# EAGLE design AnySensePro (EAGLE 7.0.0)
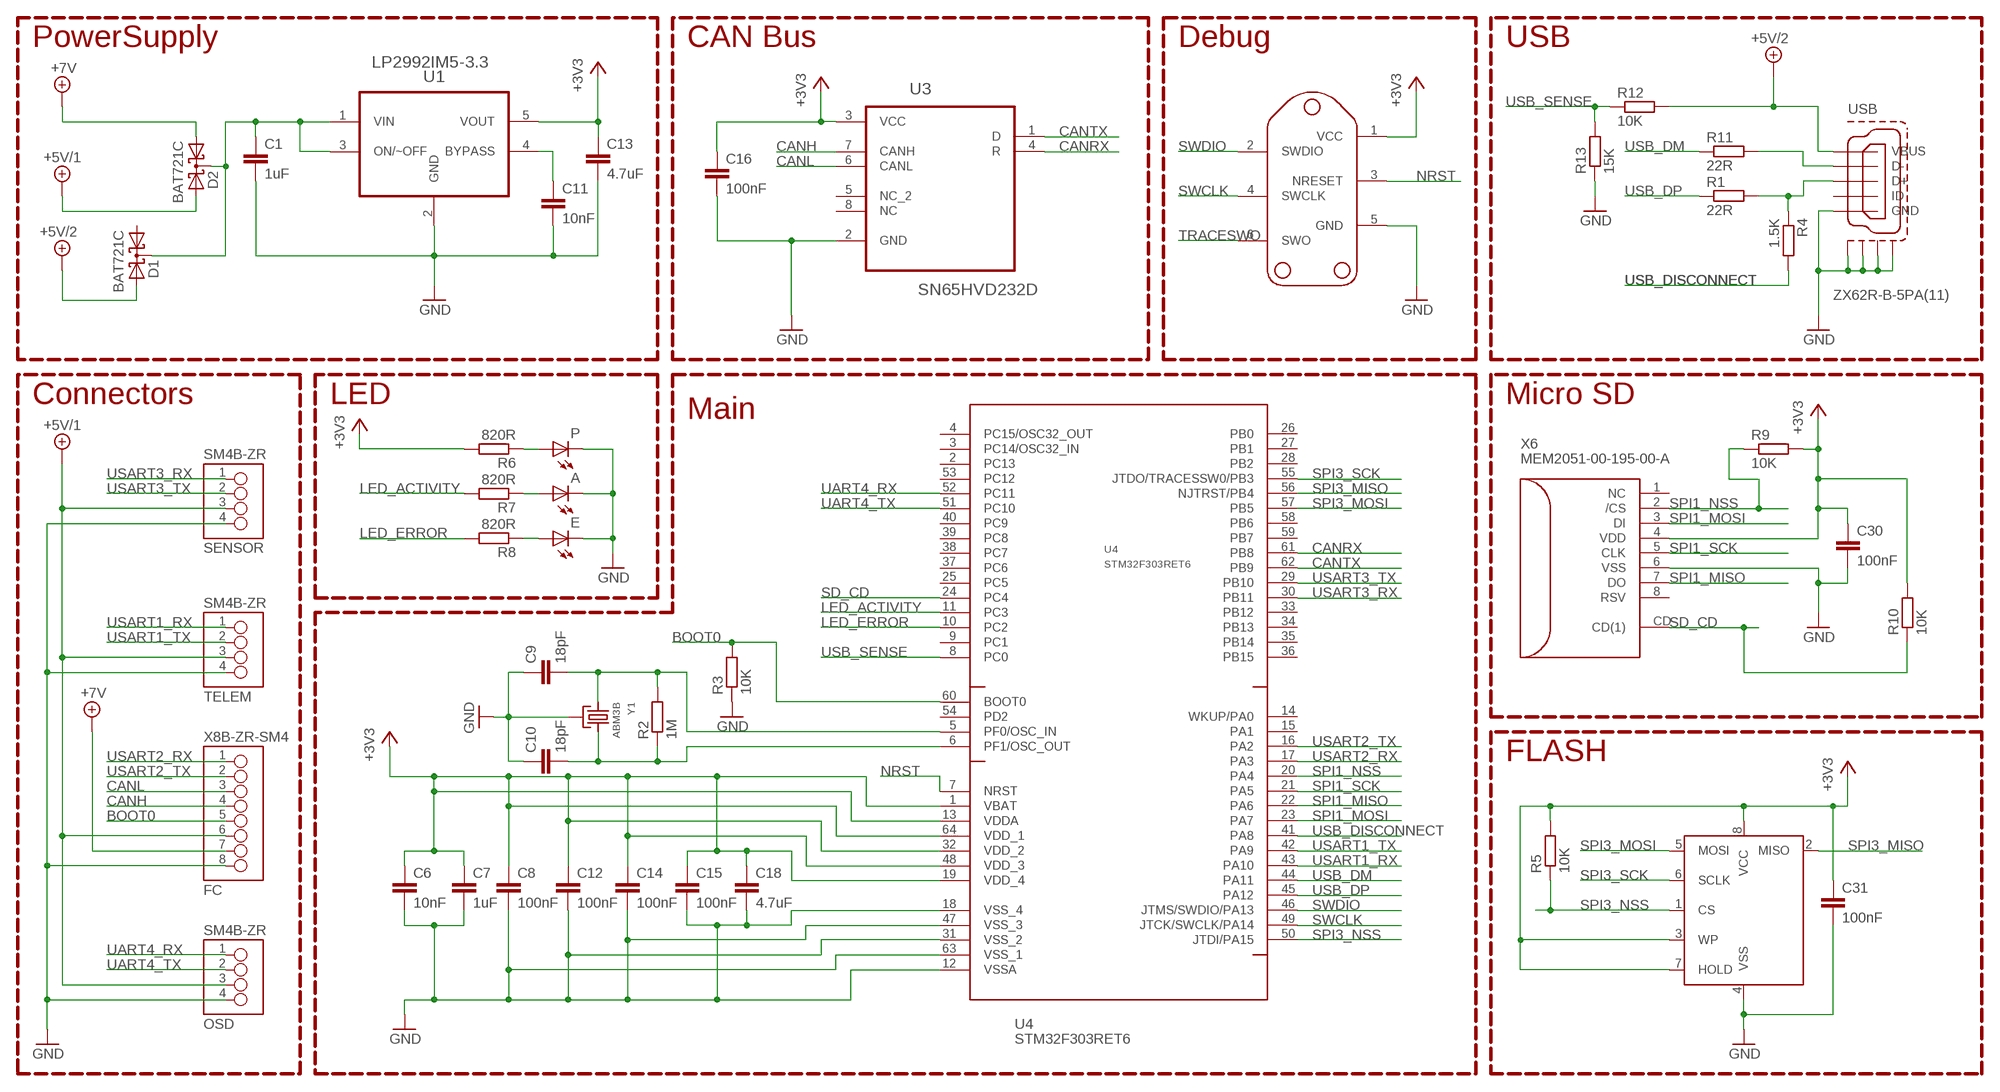
[diagram p0: schematic, sheet 1]

## Parts
A  LEDCHIP-LED0603  [CHIP-LED0603]
C1  1uF  C-EUC0603K  [C0603K]
C6  10nF  C-EUC0402K  [C0402K]
C7  1uF  C-EUC0402K  [C0402K]
C8  100nF  C-EUC0402K  [C0402K]
C9  18pF  C-EUC0402K  [C0402K]
C10  18pF  C-EUC0402K  [C0402K]
C11  10nF  C-EUC0402K  [C0402K]
C12  100nF  C-EUC0402K  [C0402K]
C13  4.7uF  C-EUC0603K  [C0603K]
C14  100nF  C-EUC0402K  [C0402K]
C15  100nF  C-EUC0402K  [C0402K]
C16  100nF  C-EUC0402K  [C0402K]
C18  4.7uF  C-EUC0603K  [C0603K]
C30  100nF  C-EUC0402K  [C0402K]
C31  100nF  C-EUC0402K  [C0402K]
D1  BAT721C  [SOT23]
D2  BAT721C  [SOT23]
E  LEDCHIP-LED0603  [CHIP-LED0603]
FC  X8B-ZR-SM4  [S8B-ZR-SM4]
OSD  SM4B-ZR  [S4B-ZR-SM4]
P  LEDCHIP-LED0603  [CHIP-LED0603]
R1  22R  R-EU_R0402  [R0402]
R2  1M  R-EU_R0402  [R0402]
R3  10K  R-EU_R0402  [R0402]
R4  1.5K  R-EU_R0402  [R0402]
R5  10K  R-EU_R0402  [R0402]
R6  820R  R-EU_R0402  [R0402]
R7  820R  R-EU_R0402  [R0402]
R8  820R  R-EU_R0402  [R0402]
R9  10K  R-EU_R0402  [R0402]
R10  10K  R-EU_R0402  [R0402]
R11  22R  R-EU_R0402  [R0402]
R12  10K  R-EU_R0402  [R0402]
R13  15K  R-EU_R0402  [R0402]
SENSOR  SM4B-ZR  [S4B-ZR-SM4]
TELEM  SM4B-ZR  [S4B-ZR-SM4]
U1  LP2992IM5-3.3  [SOT-23]
U3  SN65HVD232D  [SOIC127P600X175-8N]
U4  STM32F303RET6  [LQFP64]
U6  M25P16VMN6P  [M25P16]
USB  ZX62R-B-5PA(11)  [ZX62R-B-5PA(11)]
X6  MEM2051-00-195-00-A  [MEM2051]
X7  TC2030-IDC-NL  [TC2030-IDC]
Y1  ABM3B  ABM3B-8.000MHZ-B2-T  [5X3.2MM]

## Nets
+3V3: C6.1 C7.1 C8.1 C12.1 C13.1 C14.1 C15.1 C16.1 C18.1 C30.1 C31.1 R5.2 R6.2 R9.2 R10.2 U1.5(VOUT) U3.3(VCC) U4.1(VBAT) U4.13(VDDA) U4.19(VDD_4) U4.32(VDD_2) U4.48(VDD_3) U4.64(VDD_1) U6.3(WP) U6.7(HOLD) U6.8(VCC) X6.4(VDD) X7.1(VCC)
+5V/1: D2.2(A2) FC.6 OSD.3 SENSOR.3 TELEM.3
+5V/2: D1.2(A2) R12.2 USB.1(VBUS)
+7V: D2.1(A1) FC.7
BOOT0: FC.5 R3.2 U4.60(BOOT0)
CANH: FC.4 U3.7(CANH)
CANL: FC.3 U3.6(CANL)
CANRX: U3.4(R) U4.61(PB8)
CANTX: U3.1(D) U4.62(PB9)
GND: A.C C1.2 C6.2 C7.2 C8.2 C9.1 C10.1 C11.2 C12.2 C13.2 C14.2 C15.2 C16.2 C18.2 C30.2 C31.2 E.C FC.8 OSD.4 P.C R3.1 R13.1 SENSOR.4 TELEM.4 U1.2(GND) U3.2(GND) U4.12(VSSA) U4.18(VSS_4) U4.31(VSS_2) U4.47(VSS_3) U4.63(VSS_1) U6.4(VSS) USB.5(GND) USB.M1(S1) USB.M2(S2) USB.M3(S3) USB.M4(S4) X6.6(VSS) X7.5(GND) Y1.2(GND) Y1.4(GND)
LED_ACTIVITY: R7.2 U4.11(PC3)
LED_ERROR: R8.2 U4.10(PC2)
N$1: C1.1 D1.3(CC) D2.3(CC) U1.1(VIN) U1.3(ON/~OFF)
N$6: C10.2 R2.1 U4.6(PF1/OSC_OUT) Y1.3
N$7: C11.1 U1.4(BYPASS)
N$8: C9.2 R2.2 U4.5(PF0/OSC_IN) Y1.1
N$15: P.A R6.1
N$18: A.A R7.1
N$19: E.A R8.1
NRST: U4.7(NRST) X7.3(NRESET)
SD_CD: R10.1 U4.24(PC4) X6.CD(CD(1))
SPI1_MISO: U4.22(PA6) X6.7(DO)
SPI1_MOSI: U4.23(PA7) X6.3(DI)
SPI1_NSS: R9.1 U4.20(PA4) X6.2(/CS)
SPI1_SCK: U4.21(PA5) X6.5(CLK)
SPI3_MISO: U4.56(NJTRST/PB4) U6.2(MISO)
SPI3_MOSI: U4.57(PB5) U6.5(MOSI)
SPI3_NSS: R5.1 U4.50(JTDI/PA15) U6.1(CS)
SPI3_SCK: U4.55(JTDO/TRACESSW0/PB3) U6.6(SCLK)
SWCLK: U4.49(JTCK/SWCLK/PA14) X7.4(SWCLK)
SWDIO: U4.46(JTMS/SWDIO/PA13) X7.2(SWDIO)
TRACESWO: X7.6(SWO)
UART4_RX: OSD.1 U4.52(PC11)
UART4_TX: OSD.2 U4.51(PC10)
USART1_RX: TELEM.1 U4.43(PA10)
USART1_TX: TELEM.2 U4.42(PA9)
USART2_RX: FC.1 U4.17(PA3)
USART2_TX: FC.2 U4.16(PA2)
USART3_RX: SENSOR.1 U4.30(PB11)
USART3_TX: SENSOR.2 U4.29(PB10)
USB_D+: R1.2 R4.1 USB.3(D+)
USB_D-: R11.2 USB.2(D-)
USB_DISCONNECT: R4.2 U4.41(PA8)
USB_DM: R11.1 U4.44(PA11)
USB_DP: R1.1 U4.45(PA12)
USB_SENSE: R12.1 R13.2 U4.8(PC0)
Unconnected: D1.1(A1) U3.5(NC_2) U3.8(NC) U4.2(PC13) U4.3(PC14/OSC32_IN) U4.4(PC15/OSC32_OUT) U4.9(PC1) U4.14(WKUP/PA0) U4.15(PA1) U4.25(PC5) U4.26(PB0) U4.27(PB1) U4.28(PB2) U4.33(PB12) U4.34(PB13) U4.35(PB14) U4.36(PB15) U4.37(PC6) U4.38(PC7) U4.39(PC8) U4.40(PC9) U4.53(PC12) U4.54(PD2) U4.58(PB6) U4.59(PB7) USB.4(ID) X6.1(NC) X6.8(RSV)

## Notes on the sheet
- PowerSupply | CAN Bus | Debug | USB
- Connectors | LED | Micro SD
- Main
- FLASH

## Library data of the parts
A = led:LED: LED OSRAM: - CHIPLED LG R971, LG N971, LY N971, LG Q971, LY Q971, LO R971, LY R971 LH N974, LH R974 LS Q976, LO Q976, LY Q976 LO Q996 - Hyper CHIPLED LW Q18S LB Q993, LB Q99A, LB R99A - SideLED LS A670, LO A670, LY A670, LG A670, LP A670 LB A673, LV A673, LT A673, LW A673 LH A674 LY A675 LS A676, LA A676, LO A676, LY A676, LW A676 LS A679, LY A679, LG A679 - Hyper Micro SIDELED® LS Y876, LA Y876, LO Y876, LY Y876 LT Y87S - SmartLED LW L88C, LW L88S LB L89C, LB L89S, LG L890 LS L89K, LO L89K, LY L89K LS L896, LA L896, LO L896, LY L896 - TOPLED LS T670, LO T670, LY T670, LG T670, LP T670 LSG T670, LSP T670, LSY T670, LOP T670, LYG T670 LG T671, LOG T671, LSG T671 LB T673, LV T673, LT T673, LW T673 LH T674 LS T676, LA T676, LO T676, LY T676, LB T676, LH T676, LSB T676, LW T676 LB T67C, LV T67C, LT T67C, LS T67K, LO T67K, LY T67K, LW E67C LS E67B, LA E67B, LO E67B, LY E67B, LB E67C, LV E67C, LT E67C LW T67C LS T679, LY T679, LG T679 LS T770, LO T770, LY T770, LG T770, LP T770 LB T773, LV T773, LT T773, LW T773 LH T774 LS E675, LA E675, LY E675, LS T675 LS T776, LA T776, LO T776, LY T776, LB T776 LHGB T686 LT T68C, LB T68C - Hyper Mini TOPLED® LB M676 - Mini TOPLED Santana® LG M470 LS M47K, LO M47K, LY M47K Source: http://www.osram.convergy.de LUXEON: - LUMILED® LXK2-PW12-R00, LXK2-PW12-S00, LXK2-PW14-U00, LXK2-PW14-V00 LXK2-PM12-R00, LXK2-PM12-S00, LXK2-PM14-U00 LXK2-PE12-Q00, LXK2-PE12-R00, LXK2-PE12-S00, LXK2-PE14-T00, LXK2-PE14-U00 LXK2-PB12-K00, LXK2-PB12-L00, LXK2-PB12-M00, LXK2-PB14-N00, LXK2-PB14-P00, LXK2-PB14-Q00 LXK2-PR12-L00, LXK2-PR12-M00, LXK2-PR14-Q00, LXK2-PR14-R00 LXK2-PD12-Q00, LXK2-PD12-R00, LXK2-PD12-S00 LXK2-PH12-R00, LXK2-PH12-S00 LXK2-PL12-P00, LXK2-PL12-Q00, LXK2-PL12-R00 Source: www.luxeon.com KINGBRIGHT: KA-3528ASYC Source: www.kingbright.com; OC_FARNELL: 2468793RL
C1 = rcl:C-EU: CAPACITOR, European symbol; OC_FARNELL: 1759409RL
C6 C11 = rcl:C-EU: CAPACITOR, European symbol; OC_FARNELL: 1758924RL
C7 = rcl:C-EU: CAPACITOR, European symbol; OC_FARNELL: 2320776RL
C8 C12 C14-C16 C30 C31 = rcl:C-EU: CAPACITOR, European symbol; OC_FARNELL: 1759380RL
C9 C10 = rcl:C-EU: CAPACITOR, European symbol; OC_FARNELL: 1758947RL
C13 C18 = rcl:C-EU: CAPACITOR, European symbol; OC_FARNELL: 2320818RL
D1 D2 = diode:BAT721C: Schottky Diodes Source: Datasheet BAT721 series <http://www.farnell.com/datasheets/453891.pdf>; OC_FARNELL: 1081199RL
E = led:LED: LED OSRAM: - CHIPLED LG R971, LG N971, LY N971, LG Q971, LY Q971, LO R971, LY R971 LH N974, LH R974 LS Q976, LO Q976, LY Q976 LO Q996 - Hyper CHIPLED LW Q18S LB Q993, LB Q99A, LB R99A - SideLED LS A670, LO A670, LY A670, LG A670, LP A670 LB A673, LV A673, LT A673, LW A673 LH A674 LY A675 LS A676, LA A676, LO A676, LY A676, LW A676 LS A679, LY A679, LG A679 - Hyper Micro SIDELED® LS Y876, LA Y876, LO Y876, LY Y876 LT Y87S - SmartLED LW L88C, LW L88S LB L89C, LB L89S, LG L890 LS L89K, LO L89K, LY L89K LS L896, LA L896, LO L896, LY L896 - TOPLED LS T670, LO T670, LY T670, LG T670, LP T670 LSG T670, LSP T670, LSY T670, LOP T670, LYG T670 LG T671, LOG T671, LSG T671 LB T673, LV T673, LT T673, LW T673 LH T674 LS T676, LA T676, LO T676, LY T676, LB T676, LH T676, LSB T676, LW T676 LB T67C, LV T67C, LT T67C, LS T67K, LO T67K, LY T67K, LW E67C LS E67B, LA E67B, LO E67B, LY E67B, LB E67C, LV E67C, LT E67C LW T67C LS T679, LY T679, LG T679 LS T770, LO T770, LY T770, LG T770, LP T770 LB T773, LV T773, LT T773, LW T773 LH T774 LS E675, LA E675, LY E675, LS T675 LS T776, LA T776, LO T776, LY T776, LB T776 LHGB T686 LT T68C, LB T68C - Hyper Mini TOPLED® LB M676 - Mini TOPLED Santana® LG M470 LS M47K, LO M47K, LY M47K Source: http://www.osram.convergy.de LUXEON: - LUMILED® LXK2-PW12-R00, LXK2-PW12-S00, LXK2-PW14-U00, LXK2-PW14-V00 LXK2-PM12-R00, LXK2-PM12-S00, LXK2-PM14-U00 LXK2-PE12-Q00, LXK2-PE12-R00, LXK2-PE12-S00, LXK2-PE14-T00, LXK2-PE14-U00 LXK2-PB12-K00, LXK2-PB12-L00, LXK2-PB12-M00, LXK2-PB14-N00, LXK2-PB14-P00, LXK2-PB14-Q00 LXK2-PR12-L00, LXK2-PR12-M00, LXK2-PR14-Q00, LXK2-PR14-R00 LXK2-PD12-Q00, LXK2-PD12-R00, LXK2-PD12-S00 LXK2-PH12-R00, LXK2-PH12-S00 LXK2-PL12-P00, LXK2-PL12-Q00, LXK2-PL12-R00 Source: www.luxeon.com KINGBRIGHT: KA-3528ASYC Source: www.kingbright.com; OC_FARNELL: 2468792RL
FC = con-jst:X8B-ZR-?: JST ZH Connector; OC_FARNELL: 1830925
OSD SENSOR TELEM = con-jst:?4B-ZR: ZH Connector: 1.5mm pitch/Disconnectable Crimp style connector Datasheet <http://www.farnell.com/datasheets/621906.pdf>; OC_FARNELL: 1830923
P = led:LED: LED OSRAM: - CHIPLED LG R971, LG N971, LY N971, LG Q971, LY Q971, LO R971, LY R971 LH N974, LH R974 LS Q976, LO Q976, LY Q976 LO Q996 - Hyper CHIPLED LW Q18S LB Q993, LB Q99A, LB R99A - SideLED LS A670, LO A670, LY A670, LG A670, LP A670 LB A673, LV A673, LT A673, LW A673 LH A674 LY A675 LS A676, LA A676, LO A676, LY A676, LW A676 LS A679, LY A679, LG A679 - Hyper Micro SIDELED® LS Y876, LA Y876, LO Y876, LY Y876 LT Y87S - SmartLED LW L88C, LW L88S LB L89C, LB L89S, LG L890 LS L89K, LO L89K, LY L89K LS L896, LA L896, LO L896, LY L896 - TOPLED LS T670, LO T670, LY T670, LG T670, LP T670 LSG T670, LSP T670, LSY T670, LOP T670, LYG T670 LG T671, LOG T671, LSG T671 LB T673, LV T673, LT T673, LW T673 LH T674 LS T676, LA T676, LO T676, LY T676, LB T676, LH T676, LSB T676, LW T676 LB T67C, LV T67C, LT T67C, LS T67K, LO T67K, LY T67K, LW E67C LS E67B, LA E67B, LO E67B, LY E67B, LB E67C, LV E67C, LT E67C LW T67C LS T679, LY T679, LG T679 LS T770, LO T770, LY T770, LG T770, LP T770 LB T773, LV T773, LT T773, LW T773 LH T774 LS E675, LA E675, LY E675, LS T675 LS T776, LA T776, LO T776, LY T776, LB T776 LHGB T686 LT T68C, LB T68C - Hyper Mini TOPLED® LB M676 - Mini TOPLED Santana® LG M470 LS M47K, LO M47K, LY M47K Source: http://www.osram.convergy.de LUXEON: - LUMILED® LXK2-PW12-R00, LXK2-PW12-S00, LXK2-PW14-U00, LXK2-PW14-V00 LXK2-PM12-R00, LXK2-PM12-S00, LXK2-PM14-U00 LXK2-PE12-Q00, LXK2-PE12-R00, LXK2-PE12-S00, LXK2-PE14-T00, LXK2-PE14-U00 LXK2-PB12-K00, LXK2-PB12-L00, LXK2-PB12-M00, LXK2-PB14-N00, LXK2-PB14-P00, LXK2-PB14-Q00 LXK2-PR12-L00, LXK2-PR12-M00, LXK2-PR14-Q00, LXK2-PR14-R00 LXK2-PD12-Q00, LXK2-PD12-R00, LXK2-PD12-S00 LXK2-PH12-R00, LXK2-PH12-S00 LXK2-PL12-P00, LXK2-PL12-Q00, LXK2-PL12-R00 Source: www.luxeon.com KINGBRIGHT: KA-3528ASYC Source: www.kingbright.com; OC_FARNELL: 2468791RL
R1 R11 = rcl:R-EU_: RESISTOR, European symbol; OC_FARNELL: 2302453RL
R2 = rcl:R-EU_: RESISTOR, European symbol; OC_FARNELL: 2302957RL
R3 R5 R9 R10 R12 = rcl:R-EU_: RESISTOR, European symbol; OC_FARNELL: 2302739RL
R4 = rcl:R-EU_: RESISTOR, European symbol; OC_FARNELL: 2302656RL
R6-R8 = rcl:R-EU_: RESISTOR, European symbol; OC_FARNELL: 2302628RL
R13 = rcl:R-EU_: RESISTOR, European symbol; OC_FARNELL: 2302754RL
U1 = texas:LP2992IM5: Low-Dropout Regulator; MPN: LP2992IM5-3.3; OC_FARNELL: 1469141RL
U3 = texas:SN65HVD232D: 3.3-V CAN TRANSCEIVERS; MPN: SN65HVD232D; OC_FARNELL: 1103107; OC_NEWARK: 35K4890; PACKAGE: SOIC-8; SUPPLIER: Texas Instruments
U4 = stm32F:STM32F3: ARM® Cortex®-M4 32b MCU+FPU, up to 512KB Flash, 80KB SRAM, FMC, 4 ADCs, 2 DAC ch., 7 comp, 4 Op-Amp, 2.0-3.6 V; OC_FARNELL: 2466939
U6 = micron:M25P16; OC_FARNELL: 1734973
USB = con-hirose:ZX62R-B-5?: Micro USB Connector Source: http://www.farnell.com/datasheets/1693470.pdf; OC_FARNELL: 1645325
X6 = con-gct:MEM2051: GLOBAL CONNECTOR TECHNOLOGY MEM2051-00-195-00-A STECKPLATZ, MICRO-SD, 8POS, SMT Hersteller: GLOBAL CONNECTOR TECHNOLOGY Bestellnummer: 2443092 <http://de.farnell.com/global-connector-technology/mem2051-00-195-00-a/steckplatz-micro-sd-8pos-smt/dp/2443092> Herstellerteilenummer: MEM2051-00-195-00-A; OC_FARNELL: 2443092
X7 = con-tag-connect:TC2030-IDC-NL
Y1 = abracon:ABM; OC_FARNELL: 2467818RL

## Board
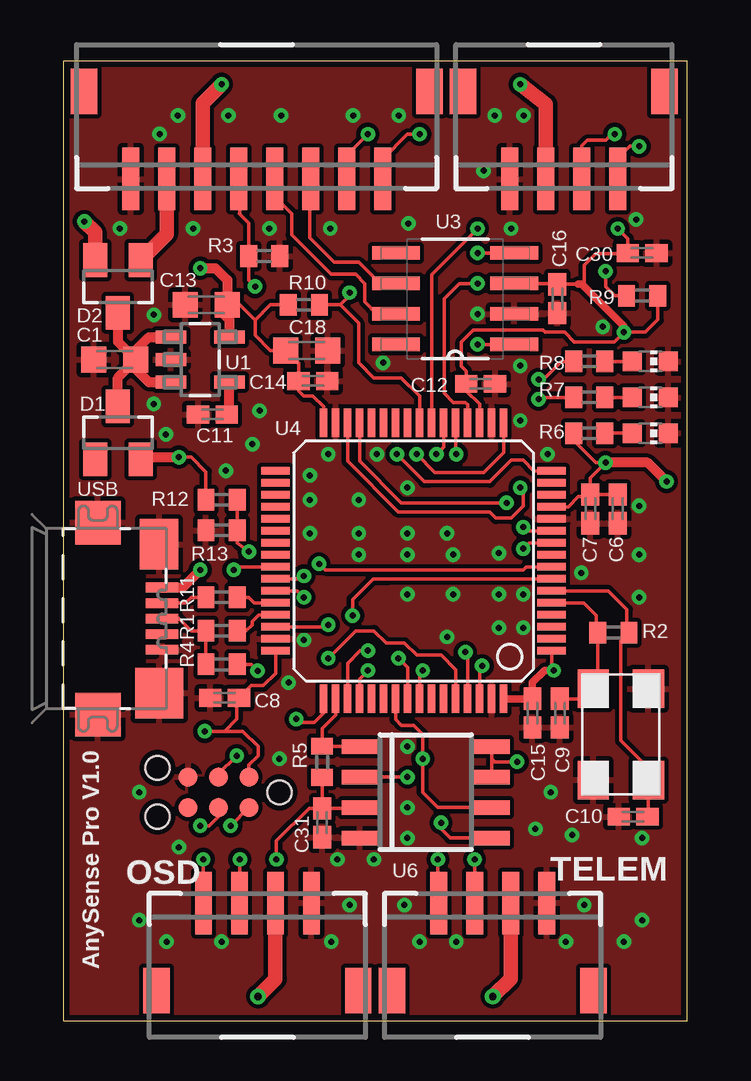
[diagram p1: board, top side]
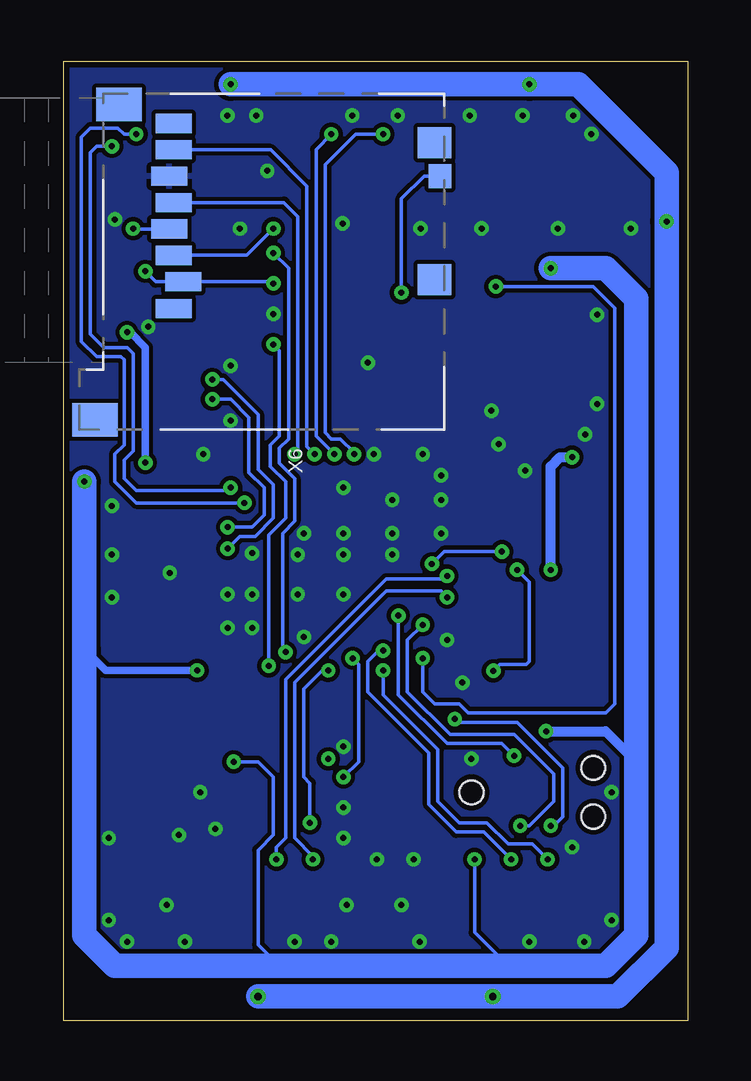
[diagram p2: board, bottom side, seen from below]

Size 26 x 40 mm. Coordinates in mm from the lower left corner, seen from the top.
Outline: 0,0 26,0 26,40 0,40 0,0
Copper layers (1*16): Top 0.035mm / dielectric 1.55mm / Bottom 0.035mm
Design rules "eC_2Layer_PClass6_BaseCopperO35 *": minimum track width 0.15mm, minimum drill 0.25mm, track to track 0.175mm, track to pad 0.175mm, pad to pad 0.175mm, via to via 0.175mm, smd to smd 0mil, copper to edge 0.25mm, drill to drill 0.35mm, minimum pad ring 0.175mm, minimum via ring 0.175mm, stop-mask expansion 0mil, vias tented up to drill 0.45mm, thermal gap 0.2mm

### Footprints (pad centres in the part's own frame; a part is rotated, then mirrored left to right if it is on the bottom)
CHIP-LED0603 = smd 0.8 x 0.8: A 0,-0.75; C 0,0.75
C0603K = smd 1.05 x 1.08: 1 -0.875,0; 2 0.875,0
C0402K = smd 0.925 x 0.74: 1 -0.6,0; 2 0.6,0
SOT23 = smd 1 x 1.4: 1 -0.95,-1.1; 2 0.95,-1.1; 3 0,1.1
S8B-ZR-SM4 = smd 0.7 x 2.6: 1 5.25,-2.6; 2 3.75,-2.6; 3 2.25,-2.6; 4 0.75,-2.6; 5 -0.75,-2.6; 6 -2.25,-2.6; 7 -3.75,-2.6; 8 -5.25,-2.6 | smd 1.1 x 1.9: P$1 7.2,1.05; P$2 -7.2,1.05
S4B-ZR-SM4 = smd 0.7 x 2.6: 1 2.25,-2.6; 2 0.75,-2.6; 3 -0.75,-2.6; 4 -2.25,-2.6 | smd 1.1 x 1.9: P$1 4.2,1.05; P$2 -4.2,1.05
R0402 = smd 0.7 x 0.9: 1 -0.65,0; 2 0.65,0
SOT-23 = smd 1.27 x 0.533: 1 -1.219,0.94; 2 -1.219,0; 3 -1.219,-0.94; 4 1.219,-0.94; 5 1.219,0.94
SOIC127P600X175-8N = smd 1.981 x 0.559: 1 -2.464,1.905; 2 -2.464,0.635; 3 -2.464,-0.635; 4 -2.464,-1.905; 5 2.464,-1.905; 6 2.464,-0.635; 7 2.464,0.635; 8 2.464,1.905
LQFP64 = smd 1.2 x 0.3: 1 -5.75,3.75; 2 -5.75,3.25; 3 -5.75,2.75; 4 -5.75,2.25; 5 -5.75,1.75; 6 -5.75,1.25; 7 -5.75,0.75; 8 -5.75,0.25; 9 -5.75,-0.25; 10 -5.75,-0.75; 11 -5.75,-1.25; 12 -5.75,-1.75; 13 -5.75,-2.25; 14 -5.75,-2.75; 15 -5.75,-3.25; 16 -5.75,-3.75; 33 5.75,-3.75; 34 5.75,-3.25; 35 5.75,-2.75; 36 5.75,-2.25; 37 5.75,-1.75; 38 5.75,-1.25; 39 5.75,-0.75; 40 5.75,-0.25; 41 5.75,0.25; 42 5.75,0.75; 43 5.75,1.25; 44 5.75,1.75; 45 5.75,2.25; 46 5.75,2.75; 47 5.75,3.25; 48 5.75,3.75 | smd 0.3 x 1.2: 17 -3.75,-5.75; 18 -3.25,-5.75; 19 -2.75,-5.75; 20 -2.25,-5.75; 21 -1.75,-5.75; 22 -1.25,-5.75; 23 -0.75,-5.75; 24 -0.25,-5.75; 25 0.25,-5.75; 26 0.75,-5.75; 27 1.25,-5.75; 28 1.75,-5.75; 29 2.25,-5.75; 30 2.75,-5.75; 31 3.25,-5.75; 32 3.75,-5.75; 49 3.75,5.75; 50 3.25,5.75; 51 2.75,5.75; 52 2.25,5.75; 53 1.75,5.75; 54 1.25,5.75; 55 0.75,5.75; 56 0.25,5.75; 57 -0.25,5.75; 58 -0.75,5.75; 59 -1.25,5.75; 60 -1.75,5.75; 61 -2.25,5.75; 62 -2.75,5.75; 63 -3.25,5.75; 64 -3.75,5.75
M25P16 = smd 0.6 x 1.5: 1 -1.905,-2.75; 2 -0.635,-2.75; 3 0.635,-2.75; 4 1.905,-2.75; 5 1.905,2.75; 6 0.635,2.75; 7 -0.635,2.75; 8 -1.905,2.75
ZX62R-B-5PA(11) = smd 1.35 x 0.4: 1 2.675,1.3; 2 2.675,0.65; 3 2.675,0; 4 2.675,-0.65; 5 2.675,-1.3 | smd 1.9 x 1.8: M1 0,-4; M2 0,4 | smd 1.6 x 2.1: M3 2.55,3.1 | smd 2 x 2.1: M4 2.55,-3.1
MEM2051 = smd 0.8 x 1.5: 1 2.06,-3.66; 2 0.94,-3.26; 3 -0.16,-3.66; 4 -1.26,-3.86; 5 -2.36,-3.66; 6 -3.46,-3.86; 7 -4.56,-3.66; 8 -5.66,-3.66 | smd 1 x 0.95: CD -3.46,7.425 | smd 1.4 x 1.9: P$1 -6.45,-5.95; P$2 6.7,-6.95 | smd 1.3 x 1.4: P$3 -4.85,7.2; P$4 0.85,7.2
TC2030-IDC = smd 0.787 x 0.787: 1 1.27,-0.635; 2 1.27,0.635; 3 2.54,-0.635; 4 2.54,0.635; 5 3.81,-0.635; 6 3.81,0.635 | hole 0.991: 0,0; 5.08,1.016; 5.08,-1.016
5X3.2MM = smd 1.6 x 1.3: 1 -1.9,-1.15; 2 1.9,-1.15; 3 1.9,1.15; 4 -1.9,1.15

### Placement (x,y rotation side)
A  24.46,25.99 270 top
C1  2.16,27.56 180 top
C6  23.11,21.34 270 top
C7  21.97,21.34 270 top
C8  6.73,13.46 180 top
C9  20.7,12.83 90 top
C10  23.75,8.51 0 top
C11  6.22,25.27 180 top
C12  17.4,26.55 0 top
C13  5.97,29.84 180 top
C14  10.41,26.67 0 top
C15  19.56,12.83 270 top
C16  20.6,30.1 270 top
C18  10.16,27.94 0 top
C30  24.13,32 0 top
C31  10.79,8.26 270 top
D1  2.29,24.51 0 top
D2  2.29,30.61 180 top
E  24.46,27.49 270 top
FC  8.07,37.69 0 top
OSD  8.1,2.31 180 top
P  24.46,24.49 270 top
R1  6.6,16.26 180 top
R2  22.93,16.18 180 top
R3  8.38,31.88 180 top
R4  6.6,14.86 0 top
R5  10.79,10.79 270 top
R6  21.93,24.49 180 top
R7  21.93,25.99 180 top
R8  21.93,27.49 180 top
R9  24.13,30.23 0 top
R10  10.03,29.84 180 top
R11  6.6,17.65 180 top
R12  6.6,21.72 180 top
R13  6.6,20.45 0 top
SENSOR  20.87,37.69 0 top
TELEM  17.9,2.31 180 top
U1  5.71,27.56 0 top
U3  16.34,30.1 180 top
U4  14.61,19.18 180 top
U6  15.11,9.53 270 top
USB  1.45,16.76 0 top
X6  17.76,31.75 270 bottom
X7  9.02,9.53 180 top
Y1  23.24,11.94 270 top

### Tracks (layer width: path | path; a pad name or v marks a point on that pad's centre or on a via)
+3V3  (via drill 0.25)
  Top 0.15: 21.84,23.62 22.2,23.27 v22.61,23.27 | 16.8,27.09 16.6,27.29 16.6,28.3 17.1,28.8 20,28.8 20.1,28.7 20.9,28.7 21.3,28.3 22.97,28.3 v23.37,28.7
  Top 0.152: U6.8 17.86,10.92 | 17.86,10.92 U6.7 | 8,29.21 8,28.57 8.64,27.94 C18.1 9.81,27.41 C14.1 9.81,26.25 10.03,26.04 10.41,26.04 10.86,25.59 U4.32 | 8,29.21 7.37,29.84 C13.1 | U4.1 20.36,14.7 v20.45,14.61 | 8,29.21 8.64,29.84 R10.2 | U4.48 8.86,14.48 8.35,13.97 7.84,13.97 C8.1 7.24,13.37 7.24,12.57 6.73,12.06 | 21.46,30.7 C16.1 20.57,30.73 U3.3 | 21.84,23.62 21.27,24.19 R6.2 | U4.13 21.05,21.43 21.46,21.84 21.88,21.84 C7.1 | C7.1 21.97,22.63 v22.61,23.27 | C7.1 21.97,21.84 | U4.19 17.36,25.7 16.8,26.25 C12.1 16.8,27.09 | R9.2 24.78,29.23 24.26,28.7 v23.37,28.7 | C7.1 C6.1 | C31.1 12.2,8.86 U6.3 | v5.91,12.06 6.73,12.06 | 6.73,12.06 7.49,12.06 8.13,11.43 8.13,11.05 7.75,10.67 X7.1 | 21.62,30.7 21.72,30.73 21.72,31.5 22.19,31.97 23.5,31.97 C30.1 23.53,32.6 v23.11,33.02 | C31.1 10.25,8.86 8.89,7.49 v8.89,6.73 | R5.2 C31.1 | v18.92,10.79 17.99,10.79 17.86,10.92
  Top 0.305: v23.37,28.7 23.37,28.96 21.62,30.7 21.46,30.7 | v20.45,14.61 20.07,14.61 19.56,14.1 C15.1 U4.64
  Top 0.406: v5.71,31.37 6.35,31.37 6.84,30.88 C13.1 6.55,29.61 6.93,29.23 U1.5 | v25.15,22.48 24.36,23.27 v22.61,23.27
  Bottom 0.152: 2.54,14.1 2.16,14.48 | X6.4 v23.1,33.01 v23.11,33.02 | v8.89,6.73 8.89,3.68 7.49,2.29 | 17.02,2.29 17.91,3.17 17.91,7.11 17.27,7.75 17.27,10.16 17.91,10.79 v18.92,10.79
  Bottom 0.305: v20.45,14.61 24.26,14.61 25.15,15.49 | v22.61,23.27 22.61,28.07 23.24,28.7 v23.37,28.7
  Bottom 0.406: v5.91,12.06 3.43,12.06 2.16,10.79
  Bottom 1.016: v5.71,31.37 3.43,31.37 2.16,30.1 2.16,14.48 2.16,10.79 2.16,3.56 3.43,2.29 7.49,2.29 17.02,2.29 23.88,2.29 25.15,3.56 25.15,15.49 v25.15,22.48
+5V/1  (via drill 0.25, 0.3)
  Top 0.61: v0.89,33.32 1.34,32.87 D2.2 | v19.05,39.04 20.12,38.2 SENSOR.3 | FC.6 5.82,38.25 v6.6,39.04 | TELEM.3 18.65,1.76 v17.91,1.02 | v8.13,1.02 8.85,1.74 OSD.3
  Bottom 1.016: v19.05,39.04 v6.6,39.04 4.57,39.04 0.89,35.35 v0.89,33.32 0.89,3.05 2.92,1.02 v8.13,1.02 v17.91,1.02
+5V/2  (via drill 0.25)
  Top 0.152: R12.2 5.95,22.88 5.33,23.5 v4.83,23.5
  Top 0.254: 3.32,23.5 D1.2
  Top 0.406: USB.1 4.98,18.06 v5.71,18.8 | 3.32,23.5 v4.83,23.5
  Bottom 0.406: v5.71,18.8 5.71,23.11 5.33,23.5 v4.83,23.5
+7V
  Top 0.61: FC.7 4.32,32.79 D2.1
BOOT0  (via drill 0.25)
  Top 0.152: FC.5 7.37,34.31 7.37,33.66 7.35,33.64 7.73,33.26 R3.2 7.73,30.88 v8,30.61 | v11.05,15.11 12.19,16.26 12.95,16.26 13.46,15.75 14.22,15.75 14.73,15.24 15.75,15.24 16.36,14.63 U4.60
  Bottom 0.152: v8,30.61 3.94,30.61 3.05,29.72 3.05,13.21 3.43,12.83 9.14,12.83 9.53,13.21 10.54,13.21 11.05,13.72 v11.05,15.11
CANH
  Top 0.152: FC.4 8.82,34.36 9.53,33.66 9.53,32.77 11.18,31.11 12.19,31.11 12.57,30.73 12.57,29.97 13.08,29.46 U3.7
CANL
  Top 0.152: FC.3 10.29,34.33 10.29,32.64 11.3,31.62 12.32,31.62 13.21,30.73 U3.6
CANRX  (via drill 0.25)
  Top 0.152: U3.4 v17.27,32 | v16.76,15.37 16.86,15.28 U4.61
  Bottom 0.152: v17.27,32 16.64,31.37 16.64,24.26 17.02,23.88 17.02,23.24 16.38,22.61 16.38,20.83 16.89,20.32 16.89,15.49 v16.76,15.37
CANTX  (via drill 0.25)
  Top 0.152: v17.27,28.19 U3.1 | U4.62 17.36,14.69 v17.46,14.8
  Bottom 0.152: v17.27,28.19 17.02,27.94 17.02,24.38 17.4,24 17.4,23.11 16.76,22.48 16.76,20.95 17.46,20.26 v17.46,14.8
GND  (via drill 0.25, 0.25 pad 0.38)
  other vias: 22.49,28.93 13.34,27.43 13.08,23.62 14.35,19.43 16.26,17.78 18.16,17.78 17.53,35.43 16.26,19.43 18.16,19.49 12.32,20.32 12.32,19.43 12.32,21.72 11.05,23.62 10.29,22.73 10.29,21.72 10.29,20.32 4.02,36.97 4.79,37.73 6.89,37.73 9.09,37.73 12.09,37.73 13.99,37.73 17.99,37.73 19.19,37.73 14.39,33.23 6.79,22.93 7.89,24.03 3.78,25.71 3.79,29.43 8.19,25.43 24.13,7.62 24.13,4.19 23.37,3.3 20.95,3.3 16.38,3.3 14.86,3.3 11.18,3.3 6.6,3.3 3.17,4.19 4.32,3.3 4.83,7.24 3.17,9.53 11.43,6.73 12.95,6.73 14.35,7.62 9.4,14.1 10.03,15.88 18.16,16.38 14.35,8.89 19.18,17.78 19.18,16.38 14.22,4.83 11.94,4.83 21.72,4.83 19.68,8 20.32,9.53 21.21,7.75 14.35,11.43 18.67,33.02 17.27,29.46 19.05,25.02 20.19,23.62 9.02,10.92 2.37,33.03 5.42,33.03 8.59,33.03 11.13,33.03 23.88,33.4 19.05,27.3 14.35,20.32 16,20.32 24,21.46 24,19.43 24,17.65 21.59,18.67 4.29,24.44 14.35,17.78 16,16 14.35,22.23
  pour Bottom (rank 3): 0,0 26,0 26,40 0,40
  pour Top (rank 5): 0,40 26,40 26,0 0,0
LED_ACTIVITY  (via drill 0.25)
  Top 0.152: v19.18,20.57 19.32,20.43 U4.11 | R7.2 19.89,25.99 v19.81,25.91
  Bottom 0.152: v19.81,25.91 19.05,25.91 18.29,25.15 18.29,22.86 17.65,22.23 17.65,21.08 18.16,20.57 v19.18,20.57
LED_ERROR  (via drill 0.25)
  Top 0.152: R8.2 20.75,27.49 20,26.73 v19.81,26.73 | v19.18,19.68 19.42,19.93 U4.10
  Bottom 0.152: 18.92,19.94 v19.18,19.68 18.67,20.19 18.03,20.19 17.27,20.95 17.27,22.35 17.91,22.99 17.91,25.27 19.37,26.73 v19.81,26.73
N$1
  Top 0.406: U1.1 3.57,28.5 3.03,27.96 C1.1 | U1.3 3.57,26.62 3.03,27.16 C1.1 | D2.3 2.29,28.31 C1.1 | D1.3 2.29,26.81 C1.1
N$6
  Top 0.152: U4.6 22.71,17.93 23.5,17.14 23.5,16.27 R2.1 23.24,15.84 23.24,11.68 24.39,10.53 Y1.3 24.39,8.55 C10.2
N$7
  Top 0.406: C11.1 6.93,25.38 U1.4
N$8
  Top 0.152: C9.2 21.68,13.43 Y1.1 22.28,14.03 R2.2 22.23,16.24 22.23,16.89 21.69,17.43 U4.5
N$15
  Top 0.152: P.A R6.1
N$18
  Top 0.152: A.A R7.1
N$19
  Top 0.152: E.A R8.1
NRST  (via drill 0.25)
  Top 0.15: v12.06,16.89 12.06,17.57 12.93,18.43 13.6,18.43
  Top 0.152: U4.7 13.6,18.43 | v7.24,11.05 6.48,10.29 X7.3
  Bottom 0.152: v12.06,16.89 12.06,13.59 10.03,11.56 7.75,11.56 v7.24,11.05
SD_CD  (via drill 0.25)
  Top 0.152: 11.56,29.84 12.32,29.08 12.32,27.43 12.95,26.8 14.1,26.8 14.86,26.04 U4.24 | R10.1 11.56,29.84 | 11.56,29.84 11.94,30.23 v11.94,30.35
  Bottom 0.152: v11.94,30.35 11.94,34.27 10.99,35.21 X6.CD
SPI1_MISO  (via drill 0.25)
  Top 0.15: U4.22 15.86,23.92 v15.56,23.62
  Top 0.152: 15.88,24.91 U4.22
  Bottom 0.15: 15.88,24 15.88,23.94 v15.56,23.62
  Bottom 0.152: 15.88,24 15.88,34.8 17.39,36.31 X6.7
SPI1_MOSI  (via drill 0.25)
  Top 0.152: v17.27,33.02 15.36,31.1 U4.23
  Bottom 0.152: v17.27,33.02 18.38,31.91 X6.3
SPI1_NSS  (via drill 0.25)
  Top 0.152: v22.61,31.24 22.61,30.61 22.99,30.23 R9.1 | U4.20 16.86,25.69 16.76,25.78 16.26,25.78 15.88,26.16 15.88,30.1 16.51,30.73 v17.27,30.73
  Bottom 0.152: v22.61,31.24 22.17,30.81 X6.2 17.35,30.81 v17.27,30.73
SPI1_SCK  (via drill 0.25)
  Top 0.152: U4.21 16.36,23.65 v16.38,23.62
  Bottom 0.152: v16.38,23.62 16.26,23.75 16.26,33.53 16.84,34.11 X6.5
SPI3_MISO  (via drill 0.25)
  Top 0.152: v13.97,15.11 14.36,14.73 U4.56 | U6.2 v14.35,10.16
  Bottom 0.152: v13.97,15.11 13.72,14.86 13.72,10.79 v14.35,10.16
SPI3_MOSI  (via drill 0.25)
  Top 0.152: U6.5 16.13,7.62 15.75,8 v15.75,8.26 | U4.57 14.86,14.47 v14.99,14.61
  Bottom 0.152: v15.75,8.26 15.75,9.91 16,10.16 16,13.84 15.24,14.61 v14.99,14.61
SPI3_NSS
  Top 0.152: U6.1 10.81,11.43 R5.1 10.79,12.19 11.36,12.75 U4.50
SPI3_SCK  (via drill 0.25)
  Top 0.152: U4.55 13.86,12.56 14.1,12.32 14.61,12.32 14.99,11.94 v14.99,10.92 14.99,9.53 15.62,8.89 U6.6
SWCLK  (via drill 0.25)
  Top 0.15: 6.1,8.13 6.48,8.51 X7.4
  Top 0.152: U4.49 10.86,12.83 10.47,12.45 9.84,12.45 v9.72,12.57 | 6.1,8.13 v5.71,8.13
  Bottom 0.152: v9.72,12.57 9.59,12.45 7.11,12.45 5.21,10.54 5.21,8.51 5.59,8.13 v5.71,8.13
SWDIO  (via drill 0.25, 0.25 pad 0.5)
  Top 0.15: v6.99,8.13 X7.2
  Top 0.152: v11.05,16.51 10.97,16.43 U4.46
  Bottom 0.152: v11.05,16.51 11.68,15.88 11.68,13.72 9.91,11.94 7.24,11.94 5.59,10.29 5.59,9.14 6.6,8.13 v6.99,8.13
UART4_RX  (via drill 0.25)
  Top 0.152: v12.7,14.61 12.36,14.26 U4.52 | OSD.1 5.84,5.64 v5.84,6.73
  Bottom 0.152: v12.7,14.61 12.7,13.59 10.41,11.3 10.41,9.14 9.53,8.26 8.38,8.26 7.49,7.37 6.48,7.37 v5.84,6.73
UART4_TX  (via drill 0.25)
  Top 0.15: 11.86,14.9 12.38,15.43 v12.7,15.43
  Top 0.152: U4.51 11.86,14.9 | OSD.2 7.37,5.63 v7.37,6.73
  Bottom 0.15: 13.34,14.99 12.89,15.43 v12.7,15.43
  Bottom 0.152: 13.34,14.99 13.34,13.72 10.79,11.18 10.79,9.02 9.65,7.87 8.51,7.87 v7.37,6.73
USART1_RX  (via drill 0.25)
  Top 0.15: U4.43 9.76,17.93 v10.03,17.65
  Top 0.152: TELEM.1 15.62,5.62 v15.62,6.73
  Bottom 0.15: 12.57,17.91 10.29,17.91 v10.03,17.65
  Bottom 0.152: 12.57,17.91 16.38,14.1 16.38,7.62 15.62,6.86 v15.62,6.73
USART1_TX  (via drill 0.25)
  Top 0.152: v10.03,18.54 9.92,18.43 U4.42 | TELEM.2 v17.14,6.73
  Bottom 0.152: v10.03,18.54 10.16,18.41 12.57,18.41 16.76,14.22 16.76,7.62 17.14,7.24 v17.14,6.73
USART2_RX  (via drill 0.25)
  Top 0.15: 15.62,22.86 15.49,22.86 v14.73,23.62
  Top 0.152: U4.17 18.36,23.69 17.53,22.86 15.62,22.86 | FC.1 13.34,34.37 13.34,35.94 14.35,36.96 v14.86,36.96
  Bottom 0.15: 15.49,24.38 v14.73,23.62
  Bottom 0.152: 15.49,24.38 15.49,36.32 v14.86,36.96
USART2_TX  (via drill 0.25)
  Top 0.15: 15.24,22.48 15.05,22.48 v13.91,23.62
  Top 0.152: U4.16 19.62,22.93 19.18,23.37 18.67,23.37 17.78,22.48 15.24,22.48 | FC.2 11.82,36.08 v12.7,36.96
  Bottom 0.15: 14.48,24.26 13.91,23.69 v13.91,23.62
  Bottom 0.152: v12.7,36.96 13.84,36.96 15.11,35.69 15.11,24.51 14.86,24.26 14.48,24.26
USART3_RX  (via drill 0.25)
  Top 0.152: SENSOR.1 23.12,35.95 23.62,36.45 v24,36.45 | U4.30 11.86,23.32 13.97,21.21 17.78,21.21 18.03,20.95 18.67,20.95 19.18,21.46 19.18,22.1 v19.05,22.23
  Bottom 0.152: v19.05,22.23 19.18,22.1 22.99,22.1 23.5,22.61 23.5,23.37 23.11,23.75 23.11,27.81 23.37,28.07 24.33,28.07 24.89,28.63 24.89,36.2 24.64,36.45 v24,36.45
USART3_TX  (via drill 0.25)
  Top 0.15: 22.61,36.7 22.86,36.96 v22.99,36.96
  Top 0.152: v18.48,21.59 14.1,21.59 12.36,23.33 U4.29 | SENSOR.2 21.62,36.48 21.84,36.7 22.61,36.7
  Bottom 0.152: v18.48,21.59 22.99,21.59 23.88,22.48 23.88,23.62 23.5,24 23.5,27.56 23.62,27.69 24.64,27.69 25.27,28.32 25.27,36.83 24.89,37.21 23.75,37.21 23.5,36.96 v22.99,36.96
USB_D+
  Top 0.152: USB.3 4.83,16.76 5.33,16.26 R1.2 R4.1
USB_D-
  Top 0.152: USB.2 5.09,17.41 5.33,17.65 R11.2
USB_DISCONNECT  (via drill 0.25)
  Top 0.152: 7.24,14.84 R4.2 7.83,14.86 v8.1,14.59 | v7.11,18.8 7.24,18.93 U4.41
  Bottom 0.152: v7.11,18.8 6.6,18.29 6.6,14.99 6.73,14.86 7.83,14.86 v8.1,14.59
USB_DM
  Top 0.152: R11.1 7.75,17.65 7.97,17.43 U4.44
USB_DP
  Top 0.152: R1.1 7.62,16.26 7.87,16.51 7.87,16.64 8.16,16.93 U4.45
USB_SENSE  (via drill 0.25)
  Top 0.15: v10.67,19.05 10.92,18.8 19.18,18.8
  Top 0.152: R12.1 R13.2 7.25,19.92 v7.75,19.56 | 19.18,18.8 19.31,18.93 U4.8
  Bottom 0.152: v7.75,19.56 10.16,19.56 v10.67,19.05

### Text on the board
tNames: AnySense Pro V1.0